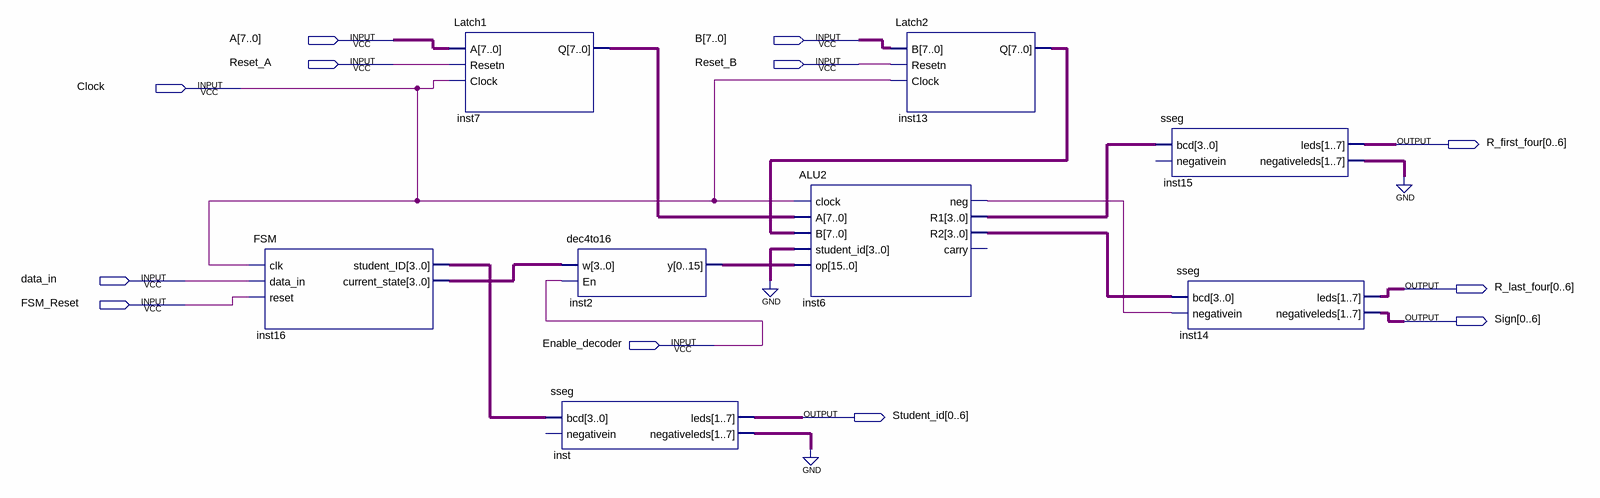
[diagram p0: schematic sheet]
// Quartus schematic Block2.bdf as structural Verilog: 8 symbols, 12 pins
module Block2 (
  input  [7:0] A,
  input  [7:0] B,
  input  Reset_A,
  input  Reset_B,
  input  Clock,
  input  data_in,
  input  FSM_Reset,
  input  Enable_decoder,
  output [0:6] R_first_four,
  output [0:6] R_last_four,
  output [0:6] Sign,
  output [0:6] Student_id
);

  wire inst6_neg;
  wire [3:0] inst6_r1, inst6_r2, inst16_current_state, inst16_student_id;
  wire [6:0] inst15_negativeleds, inst_negativeleds;
  wire [7:0] inst7_q, inst13_q;
  wire [15:0] inst2_y;

  FSM inst16 (
    .clk(Clock), .data_in(data_in), .reset(FSM_Reset), .student_ID(inst16_student_id),
    .current_state(inst16_current_state));
  Latch1 inst7 (.A(A), .Resetn(Reset_A), .Clock(Clock), .Q(inst7_q));
  dec4to16 inst2 (.w(inst16_current_state), .En(Enable_decoder), .y(inst2_y));
  sseg inst (.bcd(inst16_student_id), .leds(Student_id), .negativeleds(inst_negativeleds));  // open: negativein
  ALU2 inst6 (
    .clock(Clock), .A(inst7_q), .B(inst13_q), .student_id(4'b0000), .op(inst2_y), .neg(inst6_neg),
    .R1(inst6_r1), .R2(inst6_r2));  // open: carry
  Latch2 inst13 (.B(B), .Resetn(Reset_B), .Clock(Clock), .Q(inst13_q));
  sseg inst15 (.bcd(inst6_r1), .leds(R_first_four), .negativeleds(inst15_negativeleds));  // open: negativein
  sseg inst14 (.bcd(inst6_r2), .negativein(inst6_neg), .leds(R_last_four), .negativeleds(Sign));
  // also tied to GND on the sheet: {inst_negativeleds[0], inst_negativeleds[1], inst_negativeleds[2], inst_negativeleds[3], inst_negativeleds[4], inst_negativeleds[5], inst_negativeleds[6], inst15_negativeleds[0], inst15_negativeleds[1], inst15_negativeleds[2], inst15_negativeleds[3], inst15_negativeleds[4], inst15_negativeleds[5], inst15_negativeleds[6]}
endmodule
